# EAGLE design PCB-AC2SL (EAGLE 6.4)

## Sheet 1 of 2
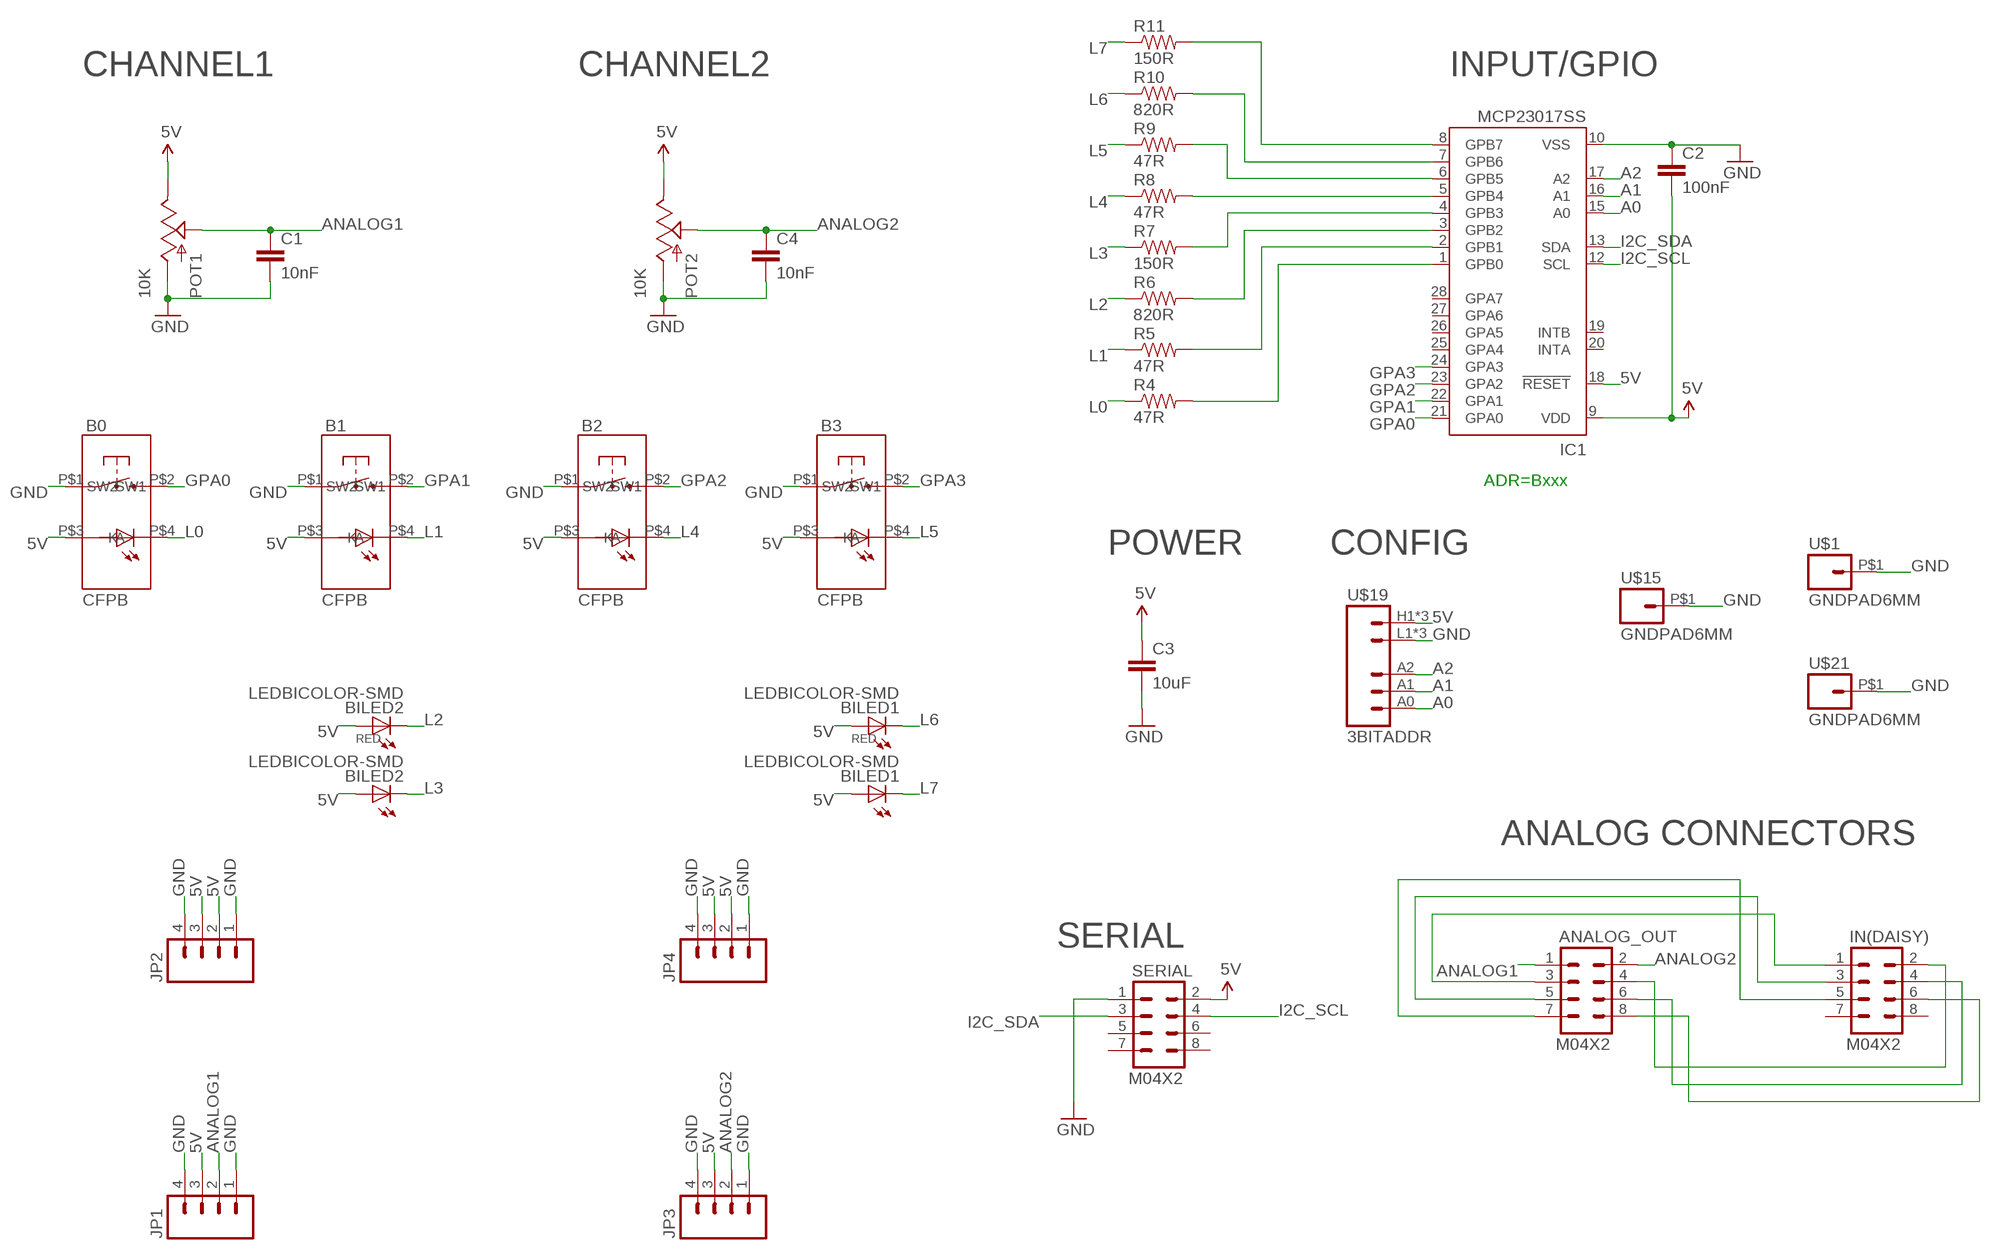
[diagram p0: schematic, sheet 1]

### Parts
ANALOG_OUT  M04X2  [2X4]
B0  CFPB  [CFPB-6/9MM]
B1  CFPB  [CFPB-6/9MM]
B2  CFPB  [CFPB-6/9MM]
B3  CFPB  [CFPB-6/9MM]
BILED1  LEDBICOLOR-SMD  [LEDBICOLOR-SMD]
BILED2  LEDBICOLOR-SMD  [LEDBICOLOR-SMD]
C1  10nF  CAP0603-CAP  [0603-CAP]
C2  100nF  CAP0603-CAP  [0603-CAP]
C3  10uF  CAP0805  [0805]
C4  10nF  CAP0603-CAP  [0603-CAP]
IC1  MCP23017SS  [SSOP28]
IN(DAISY)  M04X2  [2X4]
JP1  M04PTH  [1X04]
JP2  M04PTH  [1X04]
JP3  M04PTH  [1X04]
JP4  M04PTH  [1X04]
POT1  10K  SLIDER45  [SLIDER45]
POT2  10K  SLIDER45  [SLIDER45]
R4  47R  RESISTOR0603-RES  [0603-RES]
R5  47R  RESISTOR0603-RES  [0603-RES]
R6  820R  RESISTOR0603-RES  [0603-RES]
R7  150R  RESISTOR0603-RES  [0603-RES]
R8  47R  RESISTOR0603-RES  [0603-RES]
R9  47R  RESISTOR0603-RES  [0603-RES]
R10  820R  RESISTOR0603-RES  [0603-RES]
R11  150R  RESISTOR0603-RES  [0603-RES]
SERIAL  M04X2  [2X4]
U$1  GNDPAD6MM  [3.2MMPAD6MM]
U$15  GNDPAD6MM  [3.2MMPAD6MM]
U$19  3BITADDR  [3BITADDR]
U$21  GNDPAD6MM  [3.2MMPAD6MM]

### Nets
5V [Power]: B0.P$3(A) B1.P$3(A) B2.P$3(A) B3.P$3(A) BILED1.P$1(A) BILED1.P$3(A1) BILED2.P$1(A) BILED2.P$3(A1) C2.2 C3.1 IC1.9(VDD) IC1.18(!RESET) JP1.3 JP2.2 JP2.3 JP3.3 JP4.2 JP4.3 POT1.1(E) POT2.1(E) SERIAL.2 U$19.H1(VCC) U$19.H2(VCC) U$19.H3(VCC)
A0: IC1.15(A0) U$19.A0
A1: IC1.16(A1) U$19.A1
A2: IC1.17(A2) U$19.A2
ANALOG1: ANALOG_OUT.1 C1.1 JP1.2 POT1.2A(S)
ANALOG2: ANALOG_OUT.2 C4.1 JP3.2 POT2.2A(S)
GND [Power]: B0.P$1(SW1) B1.P$1(SW1) B2.P$1(SW1) B3.P$1(SW1) C1.2 C2.1 C3.2 C4.2 IC1.10(VSS) JP1.1 JP1.4 JP2.1 JP2.4 JP3.1 JP3.4 JP4.1 JP4.4 POT1.3(A) POT2.3(A) SERIAL.1 U$1.P$1 U$15.P$1 U$19.L1(GND) U$19.L2(GND) U$19.L3(GND) U$21.P$1
GPA0: B0.P$2(SW2) IC1.21(GPA0)
GPA1: B1.P$2(SW2) IC1.22(GPA1)
GPA2: B2.P$2(SW2) IC1.23(GPA2)
GPA3: B3.P$2(SW2) IC1.24(GPA3)
I2C_SCL: IC1.12(SCL) SERIAL.4
I2C_SDA: IC1.13(SDA) SERIAL.3
L0: B0.P$4(K) R4.1
L1: B1.P$4(K) R5.1
L2: BILED2.P$2(C) R6.1
L3: BILED2.P$4(C1) R7.1
L4: B2.P$4(K) R8.1
L5: B3.P$4(K) R9.1
L6: BILED1.P$2(C) R10.1
L7: BILED1.P$4(C1) R11.1
N$2: IC1.4(GPB3) R7.2
N$3: IC1.5(GPB4) R8.2
N$4: IC1.6(GPB5) R9.2
N$5: IC1.7(GPB6) R10.2
N$6: IC1.8(GPB7) R11.2
N$7: IC1.3(GPB2) R6.2
N$8: IC1.2(GPB1) R5.2
N$9: IC1.1(GPB0) R4.2
N$10: ANALOG_OUT.3 IN(DAISY).1
N$11: ANALOG_OUT.5 IN(DAISY).3
N$12: ANALOG_OUT.7 IN(DAISY).5
N$13: ANALOG_OUT.4 IN(DAISY).2
N$14: ANALOG_OUT.6 IN(DAISY).4
N$15: ANALOG_OUT.8 IN(DAISY).6
Unconnected: IC1.19(INTB) IC1.20(INTA) IC1.25(GPA4) IC1.26(GPA5) IC1.27(GPA6) IC1.28(GPA7) IN(DAISY).7 IN(DAISY).8 SERIAL.5 SERIAL.6 SERIAL.7 SERIAL.8

### Notes on the sheet
- CHANNEL1 | CHANNEL2 | INPUT/GPIO
- ADR=Bxxx
- POWER | CONFIG
- ANALOG CONNECTORS
- SERIAL

## Sheet 2 of 2

## Library data of the parts
ANALOG_OUT IN(DAISY) SERIAL = SparkFun:M04X2
B0 B1-B3 = SKAARHOJ:CFPB
BILED1 BILED2 = SKAARHOJ:LEDBICOLOR-SMD
C1-C4 = SparkFun:CAP: Capacitor Standard 0603 ceramic capacitor, and 0.1" leaded capacitor.
IC1 = microchip:MCP23017: http://ww1.microchip.com/downloads/en/DeviceDoc/21952a.pdf Source: http://ww1.microchip.com/downloads/en/DeviceDoc/21952a.pdf; MF: MICROCHIP; MPN: MCP23017-E/SS; OC_FARNELL: 1467674; OC_NEWARK: 31K2960
JP1-JP4 = SparkFun:M04: Header 4 Standard 4-pin 0.1" header. Use with straight break away headers (SKU : PRT-00116), right angle break away headers (PRT-00553), swiss pins (PRT-00743), machine pins (PRT-00117), and female headers (PRT-00115). Molex polarized connector foot print use with SKU : PRT-08231 with associated crimp pins and housings. 1MM SMD Version SKU: PRT-10208
POT1 POT2 = SKAARHOJ:SLIDER
R4-R11 = SparkFun:RESISTOR: Resistor Basic schematic elements and footprints for 0603, 1206, and PTH resistors.
U$1 U$15 U$21 = SKAARHOJ:GNDPAD
U$19 = SKAARHOJ:3BITADDR

## Net classes
0 default: width 0.203 mm, drill 0.406 mm, clearance 0.203 mm
1 Power: width 0.406 mm, drill 0.61 mm, clearance 0.203 mm

## Board
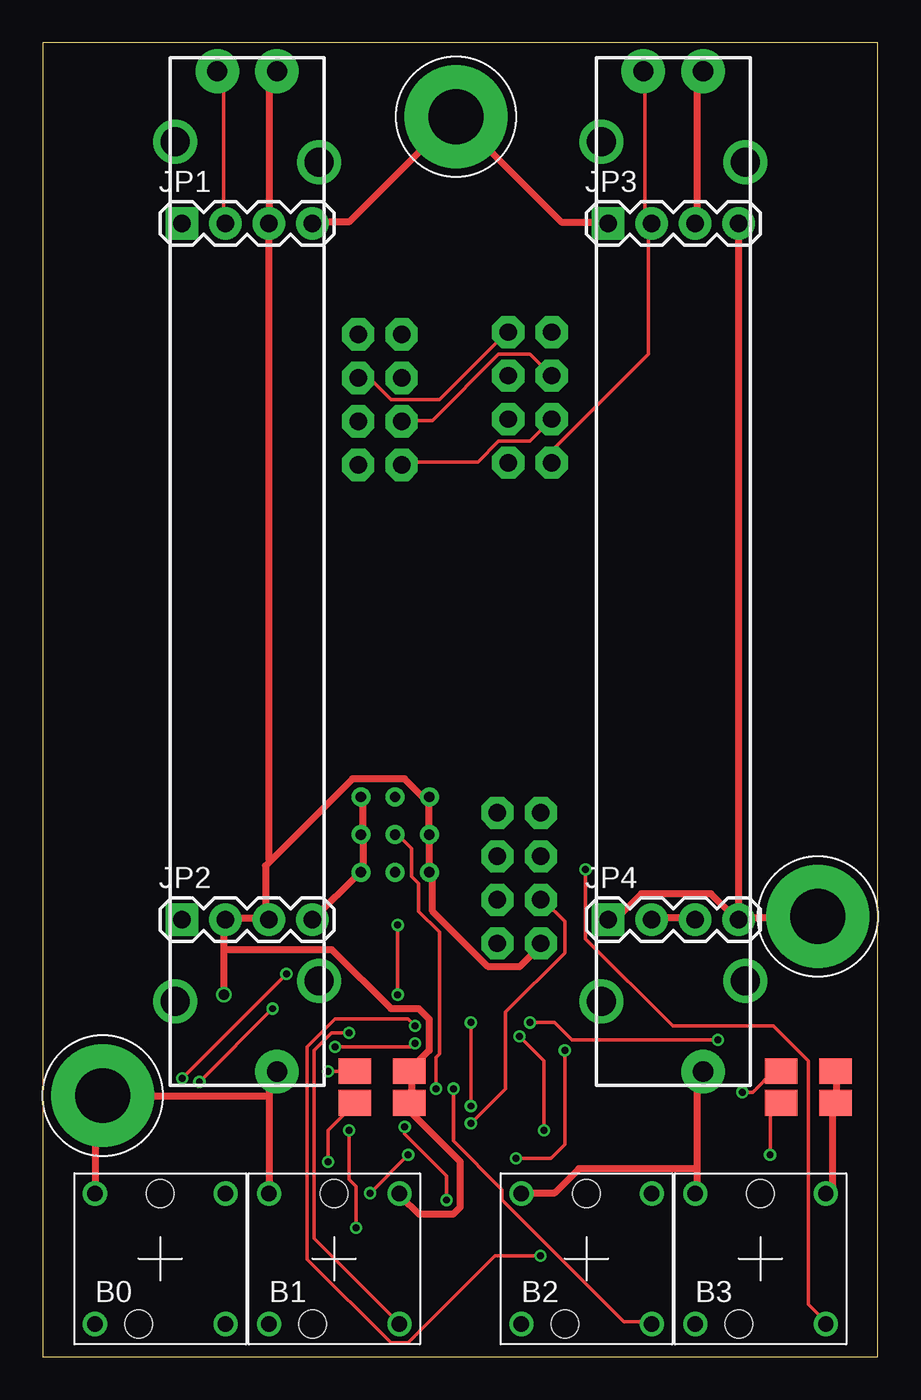
[diagram p1: board, top side]
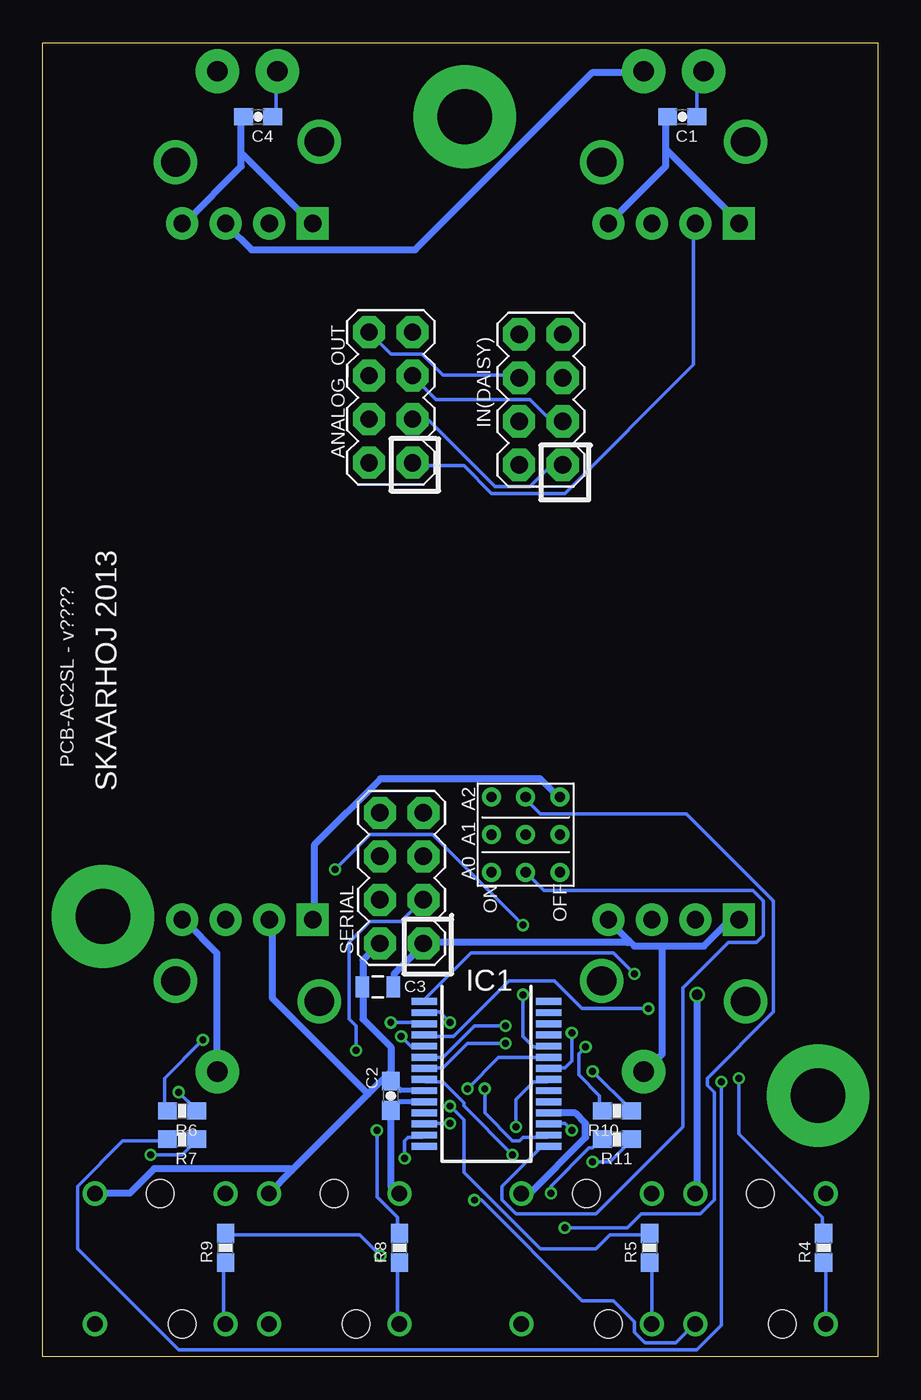
[diagram p2: board, bottom side, seen from below]

Size 48.77 x 76.71 mm. Coordinates in mm from the lower left corner, seen from the top.
Outline: 0,0 48.77,0 48.77,76.71 0,76.71 0,0
Copper layers (1*16): Top 0.035mm / dielectric 1.5mm / Bottom 0.035mm
Design rules "Fusion_eagle_rule_v1.1": minimum track width 6mil, minimum drill 12mil, track to track 6mil, track to pad 6mil, pad to pad 6mil, via to via 6mil, smd to smd 0mil, copper to edge 10mil, drill to drill 10mil, minimum pad ring 10mil, minimum via ring 6mil, stop-mask expansion 2mil, vias tented up to drill 100mil, thermal gap 10mil

### Footprints (pad centres in the part's own frame; a part is rotated, then mirrored left to right if it is on the bottom)
2X4 = drill 1.016 pad 1.88 octagon: 1 -3.81,-1.27; 2 -3.81,1.27; 3 -1.27,-1.27; 4 -1.27,1.27; 5 1.27,-1.27; 6 1.27,1.27; 7 3.81,-1.27; 8 3.81,1.27
CFPB-6/9MM = drill 0.9: P$1 -3.81,3.81; P$2 3.81,-3.81; P$3 3.81,3.81; P$4 -3.81,-3.81 | hole 1.6: 0,3.81; -1.27,-3.81
LEDBICOLOR-SMD = smd 1.9 x 1.5: P$1 1.6,0.925; P$2 -1.6,0.925; P$3 1.6,-0.925; P$4 -1.6,-0.925
0603-CAP = smd 1.1 x 1: 1 -0.85,0; 2 0.85,0
0805 = smd 0.8 x 1.2: 1 -0.9,0; 2 0.9,0
SSOP28 = smd 0.4 x 1.5: 1 -4.225,-3.625; 2 -3.575,-3.625; 3 -2.925,-3.625; 4 -2.275,-3.625; 5 -1.625,-3.625; 6 -0.975,-3.625; 7 -0.325,-3.625; 8 0.325,-3.625; 9 0.975,-3.625; 10 1.625,-3.625; 11 2.275,-3.625; 12 2.925,-3.625; 13 3.575,-3.625; 14 4.225,-3.625; 15 4.225,3.625; 16 3.575,3.625; 17 2.925,3.625; 18 2.275,3.625; 19 1.625,3.625; 20 0.975,3.625; 21 0.325,3.625; 22 -0.325,3.625; 23 -0.975,3.625; 24 -1.625,3.625; 25 -2.275,3.625; 26 -2.925,3.625; 27 -3.575,3.625; 28 -4.225,3.625
1X04 = drill 1.016 pad 1.88 square: 1 0,0 | drill 1.016 pad 1.88: 2 2.54,0; 3 5.08,0; 4 7.62,0
SLIDER45 = drill 1.194 pad 2.54: 1 -29.21,1.75; 2A -29.21,-1.75; 3 29.21,1.75 | drill 1.702: P$1 -23.9,4.2; P$2 23.9,4.2; P$3 25.1,-4.2; P$4 -25.1,-4.2
0603-RES = smd 1.1 x 1: 1 -0.85,0; 2 0.85,0
3.2MMPAD6MM = drill 3.2 pad 6: P$1 0,0
3BITADDR = drill 0.6: A0 -2.2,0; A1 0,0; A2 2.2,0; H1 -2.2,2; H2 0,2; H3 2.2,2; L1 -2.2,-2; L2 0,-2; L3 2.2,-2

### Placement (x,y rotation side)
ANALOG_OUT  28.45,56.01 90 bottom
B0  6.86,5.71 0 top
B1  17.02,5.71 0 top
B2  31.75,5.71 0 top
B3  41.91,5.71 0 top
BILED1  19.81,15.75 0 top
BILED2  44.7,15.75 0 top
C1  11.43,72.39 180 bottom
C2  28.45,15.24 90 bottom
C3  29.21,21.59 0 bottom
C4  36.2,72.39 180 bottom
IC1  22.86,16.51 270 bottom
IN(DAISY)  19.68,55.88 90 bottom
JP1  8.12,66.16 0 top
JP2  8.12,25.52 0 top
JP3  33.01,66.16 0 top
JP4  33.01,25.52 0 top
POT1  11.93,45.84 270 top
POT2  36.82,45.84 270 top
R4  3.17,6.35 90 bottom
R5  13.34,6.35 90 bottom
R6  40.64,14.35 180 bottom
R7  40.64,12.7 180 bottom
R8  27.94,6.35 90 bottom
R9  38.1,6.35 90 bottom
R10  15.24,14.35 180 bottom
R11  15.24,12.7 180 bottom
SERIAL  27.81,27.94 90 bottom
U$1  24.13,72.39 0 top
U$15  3.5,15.24 0 top
U$19  20.57,30.48 90 bottom
U$21  45.26,25.71 0 top

### Tracks (layer width: path | path; a pad name or v marks a point on that pad's centre or on a via)
5V  (via drill 0.61)
  Top 0.406: POT1.1 13.61,74.98 13.21,74.57 13.21,66.24 JP1.3 13.21,66.04 13.21,29.06 13.31,28.96 | JP3.3 38.2,66.24 38.2,74.78 38.41,74.98 POT2.1 | B1.P$3 20.93,9.35 21.95,8.33 23.98,8.33 24.38,8.74 24.38,11.38 21.54,14.22 21.54,14.63 BILED1.P$3 21.54,14.83 21.54,16.66 BILED1.P$1 21.54,16.87 22.55,17.88 22.55,19.71 21.95,20.32 20.32,20.32 16.87,23.77 10.57,23.77 | 10.57,23.77 10.57,25.4 JP2.2 10.77,25.6 13.01,25.6 JP2.3 13.01,25.81 13.01,28.65 13.31,28.96 | 10.57,23.77 v10.57,21.13 | BILED2.P$1 46.33,16.66 46.33,14.83 BILED2.P$3 46.13,14.63 46.13,9.96 45.72,9.55 B3.P$3 | JP4.2 35.56,25.6 38,25.6 JP4.3 | 22.55,30.48 22.55,28.45 U$19.H1 22.76,28.25 22.76,26.01 26.01,22.76 27.84,22.76 29.06,23.98 SERIAL.2 | 22.55,30.48 22.55,32.51 U$19.H3 22.35,32.51 21.13,33.73 18.09,33.73 13.31,28.96 | 22.55,30.48 U$19.H2
  Bottom 0.305: IC1.9 27.89,15.54 C2.2
  Bottom 0.406: POT1.1 13.82,74.98 16.66,74.98 27.03,64.62 36.58,64.62 38,66.04 JP3.3 | IC1.18 19.1,14.22 17.68,14.22 17.07,13.61 17.07,12.8 20.32,9.55 20.73,9.55 B1.P$3 | v10.57,21.13 10.57,9.55 B0.P$3 | SERIAL.2 29.26,23.98 30.07,23.16 30.07,21.74 C3.1 30.07,21.54 30.07,19.71 28.45,18.09 28.45,16.66 | 28.45,16.66 C2.2 | 28.45,16.66 29.77,15.34 | 29.77,15.34 34.24,10.87 | 34.24,10.87 35.56,9.55 B2.P$3 | 29.77,15.34 35.36,20.93 35.36,25.4 JP4.2 | B3.P$3 45.72,9.55 43.69,9.55 42.27,10.97 34.34,10.97 34.24,10.87
A0
  Bottom 0.203: IC1.15 19.3,12.19 19.71,12.19 21.95,9.96 21.95,9.14 21.13,8.33 16.46,8.33 11.38,13.41 11.38,21.54 8.74,24.18 7.11,24.18 6.71,24.59 6.71,26.62 7.32,27.23 19.51,27.23 20.52,28.25 U$19.A0
A1  (via drill 0.41)
  Top 0.203: v22.96,15.65 22.96,17.48 23.16,17.68 23.16,24.79 21.95,26.01 21.95,27.64 21.54,28.04 21.54,29.67 20.73,30.48 U$19.A1
  Bottom 0.203: v22.96,15.65 22.96,14.22 21.34,12.6 20.93,12.6 20.73,12.8 19.3,12.8 IC1.16
A2  (via drill 0.41)
  Top 0.203: v17.88,13.21 17.88,10.36 18.29,9.96 v18.29,7.52
  Bottom 0.203: v17.88,13.21 18.29,13.61 19.1,13.61 IC1.17 | v18.29,7.52 14.63,7.52 13.82,8.33 10.36,8.33 9.55,9.14 9.55,15.44 9.96,15.85 9.96,16.26 6.1,20.12 6.1,26.62 11.18,31.7 19.71,31.7 20.52,32.51 U$19.A2
ANALOG1
  Top 0.203: JP1.2 10.57,66.24 10.57,74.78 10.36,74.98 POT1.2A
  Bottom 0.203: C1.1 10.57,72.54 10.57,74.78 10.36,74.98 POT1.2A | ANALOG_OUT.1 27.03,52.02 24.18,52.02 22.55,50.39 18.29,50.39 10.77,57.91 10.77,66.04 JP1.2
ANALOG2
  Top 0.203: ANALOG_OUT.2 29.87,52.22 29.87,53.03 35.36,58.52 35.36,66.04 JP3.2 35.36,66.24 35.15,66.45 35.15,74.98 POT2.2A
  Bottom 0.203: C4.1 35.15,72.54 35.15,74.98 POT2.2A
GND
  Top 0.406: JP1.4 15.85,66.24 17.88,66.24 23.98,72.34 U$1.P$1 30.28,66.24 32.92,66.24 JP3.1 | 38.2,10.97 38.2,16.26 38.41,16.46 POT2.3 | 38.2,10.97 38.2,9.55 B3.P$1 | 38.2,10.97 31.29,10.97 29.87,9.55 28.04,9.55 B2.P$1 | JP4.1 33.12,25.6 33.53,25.6 34.95,27.03 39.01,27.03 40.44,25.6 JP4.4 | JP4.4 40.64,25.6 45.11,25.6 U$21.P$1 | 18.69,30.48 18.69,28.45 U$19.L1 18.49,28.25 15.85,25.6 JP2.4 | 18.69,30.48 18.69,32.51 U$19.L3 | 18.69,30.48 U$19.L2 | 13.21,15.24 13.21,16.05 13.61,16.46 POT1.3 | 13.21,15.24 B1.P$1 | B0.P$1 3.05,14.83 3.45,15.24 U$15.P$1 13.21,15.24 | JP3.4 40.64,66.04 40.64,25.81 JP4.4
  Bottom 0.305: IC1.10 27.95,14.88 C2.1
  Bottom 0.406: 37.19,70.31 37.19,69.49 40.44,66.24 JP3.4 | 37.19,70.31 37.19,72.34 C4.2 | 37.19,70.31 33.12,66.24 JP3.1 | 12.39,70.51 12.39,69.49 15.65,66.24 JP1.4 | 12.39,70.51 12.39,72.34 C1.2 | 12.39,70.51 8.13,66.24 JP1.1 | C2.1 28.45,9.96 28.04,9.55 B2.P$1 | POT2.3 38.61,16.66 38.61,23.57 40.44,25.4 JP4.4 | C3.2 28.25,21.74 28.25,22.35 26.62,23.98 SERIAL.1 26.42,24.18 14.63,24.18 14.53,24.28 | 12.6,23.98 14.22,23.98 14.53,24.28 | 12.6,23.98 10.16,23.98 8.74,25.4 8.13,25.4 JP2.1 | 14.53,24.28 15.65,25.4 JP2.4 | 12.6,23.98 12.6,17.68 13.61,16.66 POT1.3 | JP4.1 32.92,25.6 32.92,29.87 29.06,33.73 19.71,33.73 18.69,32.72 U$19.L3
GPA0  (via drill 0.41)
  Top 0.203: v21.13,13.41 21.13,13.01 23.57,10.57 v23.57,9.14
  Bottom 0.203: v21.13,13.41 21.13,15.04 20.12,16.05 19.3,16.05 IC1.21 | v23.57,9.14 23.16,9.14 17.27,3.25 15.44,3.25 14.22,2.03 14.22,1.42 13.61,0.81 11.79,0.81 10.77,1.83 B0.P$2
GPA1  (via drill 0.41)
  Top 0.203: v17.88,18.9 16.87,18.9 15.85,17.88 15.85,6.91 20.73,2.03 B1.P$2
  Bottom 0.203: v17.88,18.9 17.88,17.27 18.29,16.87 19.1,16.87 IC1.22
GPA2  (via drill 0.41)
  Top 0.203: v23.98,15.65 23.98,12.6 26.82,9.75 26.82,9.14 33.93,2.03 35.56,2.03 B2.P$2
  Bottom 0.203: v23.98,15.65 22.15,17.48 19.3,17.48 IC1.23
GPA3  (via drill 0.41)
  Top 0.203: v20.73,25.2 v20.73,21.13 | v31.7,28.45 31.7,24.38 36.78,19.3 42.67,19.3 44.7,17.27 44.7,3.05 45.72,2.03 B3.P$2
  Bottom 0.203: v20.73,21.13 20.73,18.69 20.12,18.09 19.3,18.09 IC1.24 | v20.73,25.2 26.01,30.48 29.67,30.48 v31.7,28.45
I2C_SCL  (via drill 0.41)
  Top 0.203: v24.99,13.61 27.03,15.65 27.03,20.12 30.48,23.57 30.48,25.4 29.26,26.62 SERIAL.4
  Bottom 0.203: v24.99,13.61 26.42,13.61 IC1.12
I2C_SDA  (via drill 0.41)
  Top 0.203: v27.64,11.58 29.67,11.58 30.48,12.39 v30.48,17.88
  Bottom 0.203: v27.64,11.58 27.64,12.6 27.43,12.8 26.62,12.8 IC1.13 | v30.48,17.88 30.48,19.3 30.89,19.71 30.89,24.18 29.67,25.4 27.84,25.4 26.62,26.62 SERIAL.3
L0
  Bottom 0.203: B0.P$4 3.05,5.49 R4.1
L1
  Bottom 0.203: B1.P$4 13.21,5.49 R5.1
L2  (via drill 0.41)
  Top 0.203: v40.84,15.44 41.45,15.44 42.67,16.66 43.08,16.66 BILED2.P$2
  Bottom 0.203: v40.84,15.44 39.83,14.43 R6.1
L3  (via drill 0.41)
  Top 0.203: v42.47,11.79 42.47,14.02 43.08,14.63 BILED2.P$4
  Bottom 0.203: v42.47,11.79 40.64,11.79 39.83,12.6 R7.1
L4
  Bottom 0.203: R8.1 28.04,5.49 28.04,2.03 B2.P$4
L5
  Bottom 0.203: R9.1 38.2,5.49 38.2,2.03 B3.P$4
L6  (via drill 0.41)
  Top 0.203: v16.66,16.66 18.09,16.66 BILED1.P$2
  Bottom 0.203: v16.66,16.66 14.43,14.43 R10.1
L7  (via drill 0.41)
  Top 0.203: v16.66,11.38 16.66,13.21 18.09,14.63 BILED1.P$4
  Bottom 0.203: v16.66,11.38 15.65,11.38 14.43,12.6 R11.1
N$2  (via drill 0.41)
  Top 0.203: v13.41,20.32 v9.14,16.05
  Bottom 0.203: v9.14,16.05 9.14,1.83 10.57,0.41 40.84,0.41 46.74,6.3 46.74,9.96 44.09,12.6 41.66,12.6 R7.2 | v13.41,20.32 17.27,20.32 18.9,21.95 21.54,21.95 24.79,18.69 26.42,18.69 IC1.4
N$3  (via drill 0.41)
  Top 0.203: v29.26,13.21 29.26,17.27 v27.84,18.69
  Bottom 0.203: v29.26,13.21 29.26,9.35 28.04,8.13 28.04,7.32 R8.2 | v27.84,18.69 27.23,18.09 26.62,18.09 IC1.5
N$4  (via drill 0.41)
  Top 0.203: v29.06,5.89 26.42,5.89 21.34,0.81 20.32,0.81 15.44,5.69 15.44,18.09 17.07,19.71 21.34,19.71 v21.74,19.3
  Bottom 0.203: v29.06,5.89 30.28,7.11 38,7.11 R9.2 | v21.74,19.3 23.57,19.3 25.4,17.48 26.42,17.48 IC1.6
N$5  (via drill 0.41)
  Top 0.203: v17.07,18.09 21.54,18.09 v21.74,18.29
  Bottom 0.203: v17.07,18.09 17.48,17.68 17.48,16.46 16.26,15.24 16.26,14.43 R10.2 | v21.74,18.29 23.98,18.29 25.4,16.87 26.42,16.87 IC1.7
N$6  (via drill 0.41)
  Top 0.203: v21.34,11.79 v19.1,9.55
  Bottom 0.203: v19.1,9.55 19.1,9.96 16.87,12.19 16.66,12.19 16.26,12.6 R11.2 | v21.34,11.79 24.18,14.63 24.18,14.83 25.4,16.05 26.42,16.05 IC1.8
N$7  (via drill 0.41)
  Top 0.203: v39.42,18.49 30.89,18.49 29.87,19.51 v28.45,19.51
  Bottom 0.203: v39.42,18.49 41.66,16.26 41.66,14.43 R6.2 | v28.45,19.51 26.62,19.51 IC1.3
N$8  (via drill 0.41)
  Top 0.203: v24.99,19.51 v24.99,14.63
  Bottom 0.203: v24.99,14.63 24.18,13.82 24.18,10.77 19.71,6.3 16.46,6.3 15.65,7.11 13.41,7.11 R5.2 | v24.99,19.51 25.6,20.12 26.42,20.12 IC1.2
N$9  (via drill 0.41)
  Top 0.203: v14.22,22.35 v8.13,16.26
  Bottom 0.203: v8.13,16.26 8.13,13.01 3.25,8.13 3.25,7.32 R4.2 | v14.22,22.35 15.44,23.57 23.77,23.57 26.42,20.93 IC1.1
N$10
  Bottom 0.203: IN(DAISY).1 18.49,52.02 19.1,52.02 20.32,50.8 22.35,50.8 26.21,54.66 27.03,54.66 ANALOG_OUT.3
N$11
  Bottom 0.203: IN(DAISY).3 18.49,54.66 19.1,54.66 20.32,55.88 25.81,55.88 27.03,57.1 ANALOG_OUT.5
N$12
  Top 0.203: IN(DAISY).5 18.49,57.1 19.1,57.1 20.32,55.88 23.16,55.88 27.03,59.74 ANALOG_OUT.7
N$13
  Top 0.203: IN(DAISY).2 21.13,52.22 25.4,52.22 26.62,53.44 28.45,53.44 29.67,54.66 ANALOG_OUT.4
N$14
  Top 0.203: IN(DAISY).4 21.13,54.66 22.76,54.66 26.62,58.52 28.45,58.52 29.67,57.3 ANALOG_OUT.6
N$15
  Bottom 0.203: IN(DAISY).6 21.13,57.3 25.4,57.3 26.62,58.52 28.45,58.52 29.67,59.74 ANALOG_OUT.8

### Text on the board
_bsilk: PCB-AC2SL - v???? | SKAARHOJ 2013